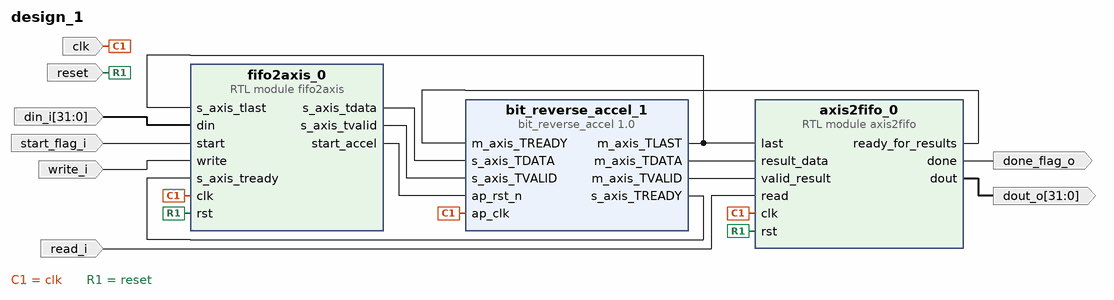
[diagram p0: block diagram of the top level]
# Vivado block design design_1, xc7a100tcsg324-3, Vivado 2023.2
create_bd_design design_1

create_bd_port -dir O done_flag_o
create_bd_port -dir O -from 31 -to 0 dout_o
create_bd_port -dir I -from 31 -to 0 din_i
create_bd_port -dir I start_flag_i
create_bd_port -dir I -type clk clk
create_bd_port -dir I -type rst reset
set_property -dict {CONFIG.POLARITY ACTIVE_HIGH} [get_bd_ports reset]
create_bd_port -dir I read_i
create_bd_port -dir I write_i

create_bd_cell -type ip -vlnv xilinx.com:hls:bit_reverse_accel:1.0 bit_reverse_accel_1
create_bd_cell -type module -reference fifo2axis fifo2axis_0
create_bd_cell -type module -reference axis2fifo axis2fifo_0

# ---- connections ----

connect_bd_net [get_bd_pins axis2fifo_0/ready_for_results] [get_bd_pins bit_reverse_accel_1/m_axis_TREADY]
connect_bd_net [get_bd_pins axis2fifo_0/done] [get_bd_ports done_flag_o]
connect_bd_net [get_bd_pins axis2fifo_0/dout] [get_bd_ports dout_o]
connect_bd_net [get_bd_pins bit_reverse_accel_1/m_axis_TDATA] [get_bd_pins axis2fifo_0/result_data]
connect_bd_net [get_bd_pins bit_reverse_accel_1/m_axis_TLAST] [get_bd_pins axis2fifo_0/last] [get_bd_pins fifo2axis_0/s_axis_tlast]
connect_bd_net [get_bd_pins bit_reverse_accel_1/m_axis_TVALID] [get_bd_pins axis2fifo_0/valid_result]
connect_bd_net [get_bd_pins bit_reverse_accel_1/s_axis_TREADY] [get_bd_pins fifo2axis_0/s_axis_tready]
connect_bd_net -net clk_0_1 [get_bd_ports clk] [get_bd_pins bit_reverse_accel_1/ap_clk] [get_bd_pins axis2fifo_0/clk] [get_bd_pins fifo2axis_0/clk]
connect_bd_net [get_bd_pins fifo2axis_0/s_axis_tdata] [get_bd_pins bit_reverse_accel_1/s_axis_TDATA]
connect_bd_net [get_bd_pins fifo2axis_0/s_axis_tvalid] [get_bd_pins bit_reverse_accel_1/s_axis_TVALID]
connect_bd_net [get_bd_pins fifo2axis_0/start_accel] [get_bd_pins bit_reverse_accel_1/ap_rst_n]
connect_bd_net -net fifo_data_0_1 [get_bd_ports din_i] [get_bd_pins fifo2axis_0/din]
connect_bd_net -net read_0_1 [get_bd_ports read_i] [get_bd_pins axis2fifo_0/read]
connect_bd_net -net rst_0_1 [get_bd_ports reset] [get_bd_pins axis2fifo_0/rst] [get_bd_pins fifo2axis_0/rst]
connect_bd_net -net start_0_1 [get_bd_ports start_flag_i] [get_bd_pins fifo2axis_0/start]
connect_bd_net -net write_0_1 [get_bd_ports write_i] [get_bd_pins fifo2axis_0/write]

validate_bd_design
save_bd_design
